# EAGLE design Adapter-LVLShifterV04 (EAGLE 7.3.0)
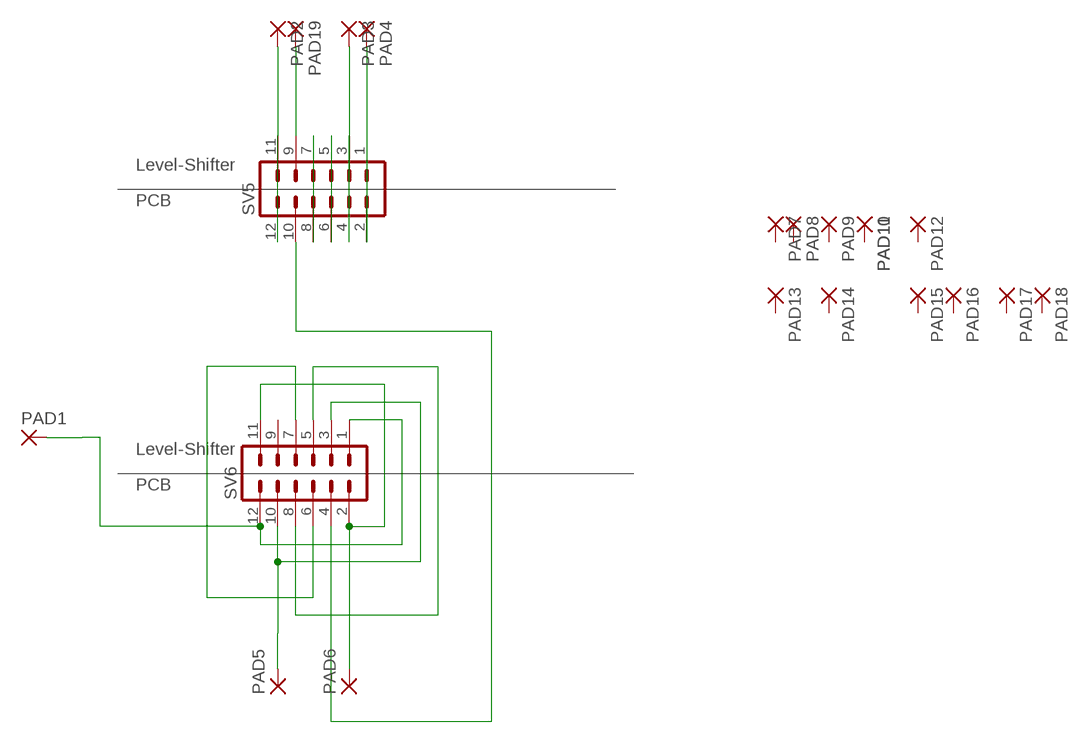
[diagram p0: schematic, sheet 1]

## Parts
PAD1  1,6/0,8  [1,6/0,8]
PAD2  1,6/0,8  [1,6/0,8]
PAD3  1,6/0,8  [1,6/0,8]
PAD4  1,6/0,8  [1,6/0,8]
PAD5  1,6/0,8  [1,6/0,8]
PAD6  1,6/0,8  [1,6/0,8]
PAD7  1,6/0,8  [1,6/0,8]
PAD8  1,6/0,8  [1,6/0,8]
PAD9  1,6/0,8  [1,6/0,8]
PAD10  1,6/0,8  [1,6/0,8]
PAD11  1,6/0,8  [1,6/0,8]
PAD12  1,6/0,8  [1,6/0,8]
PAD13  1,6/0,8  [1,6/0,8]
PAD14  1,6/0,8  [1,6/0,8]
PAD15  1,6/0,8  [1,6/0,8]
PAD16  1,6/0,8  [1,6/0,8]
PAD17  1,6/0,8  [1,6/0,8]
PAD18  1,6/0,8  [1,6/0,8]
PAD19  1,6/0,8  [1,6/0,8]
SV5  MA06-2  [MA06-2]
SV6  MA06-2  [MA06-2]

## Nets
N$1: PAD2.1(P) SV5.11 SV5.12
N$2: SV5.7 SV5.8
N$3: SV5.5 SV5.6
N$4: PAD4.1(P) SV5.1 SV5.2
N$5: PAD6.1(P) SV6.2 SV6.11
N$6: PAD1.1(P) SV6.1 SV6.12
N$7: PAD5.1(P) SV6.3 SV6.10
N$8: SV5.10 SV6.4
N$9: SV6.6 SV6.7
N$10: SV6.5 SV6.8
N$11: PAD3.1(P) SV5.3 SV5.4
N$12: PAD10.1(P) PAD11.1(P)
N$13: PAD19.1(P) SV5.9
Unconnected: PAD7.1(P) PAD8.1(P) PAD9.1(P) PAD12.1(P) PAD13.1(P) PAD14.1(P) PAD15.1(P) PAD16.1(P) PAD17.1(P) PAD18.1(P) SV6.9

## Notes on the sheet
- Level-Shifter
- PCB
- Level-Shifter
- PCB

## Library data of the parts
PAD1-PAD19 = wirepad:1,6/0,8: THROUGH-HOLE PAD
SV5 SV6 = con-lstb:MA06-2: PIN HEADER; OC_FARNELL: unknown; OC_NEWARK: unknown

## Net classes
0 default: width 0.305 mm

## Board
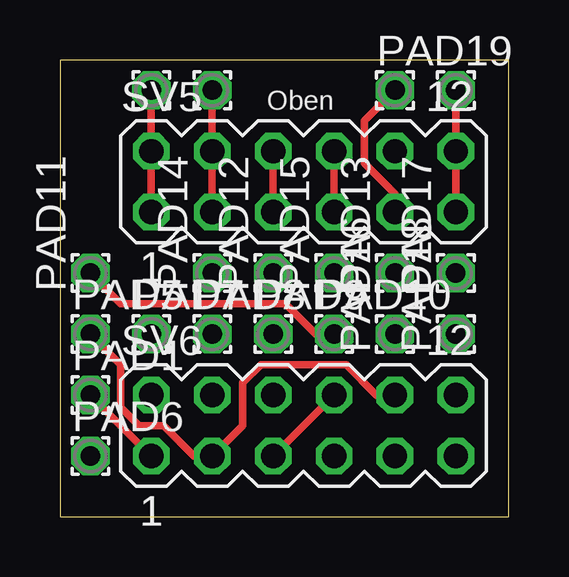
[diagram p1: board, top side]
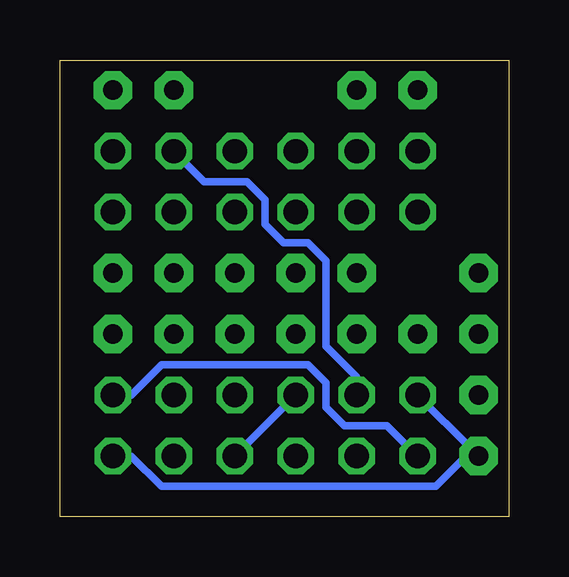
[diagram p2: board, bottom side, seen from below]

Size 18.72 x 19.04 mm. Coordinates in mm from the lower left corner, seen from the top.
Outline: 0,0 18.72,0 18.72,19.04 0,19.04 0,0
Copper layers (1*16): Top 0.035mm / dielectric 1.5mm / Bottom 0.035mm
Design rules "default": minimum track width 10mil, minimum drill 24mil, track to track 8mil, track to pad 8mil, pad to pad 8mil, via to via 8mil, smd to smd 8mil, copper to edge 40mil, drill to drill 8mil, minimum pad ring 10mil, minimum via ring 8mil, stop-mask expansion 4mil, vias tented up to drill 0mil, thermal gap 10mil

### Footprints (pad centres in the part's own frame; a part is rotated, then mirrored left to right if it is on the bottom)
1,6/0,8 = drill 0.813 pad 1.6 octagon: 1 0,0
MA06-2 = drill 1.016 octagon: 1 -6.35,-1.27; 2 -6.35,1.27; 3 -3.81,-1.27; 4 -3.81,1.27; 5 -1.27,-1.27; 6 -1.27,1.27; 7 1.27,-1.27; 8 1.27,1.27; 9 3.81,-1.27; 10 3.81,1.27; 11 6.35,-1.27; 12 6.35,1.27

### Placement (x,y rotation side)
PAD1  1.27,5.08 0 top
PAD2  16.51,17.78 0 top
PAD3  6.35,17.78 0 top
PAD4  3.81,17.78 0 top
PAD5  1.27,7.62 0 top
PAD6  1.27,2.54 0 top
PAD7  3.81,7.62 0 top
PAD8  6.35,7.62 0 top
PAD9  8.89,7.62 0 top
PAD10  11.43,7.62 0 top
PAD11  1.27,10.16 90 top
PAD12  8.89,10.16 90 top
PAD13  13.97,10.16 90 top
PAD14  6.35,10.16 90 top
PAD15  11.43,10.16 90 top
PAD16  13.97,7.62 90 top
PAD17  16.51,10.16 90 top
PAD18  16.51,7.62 90 top
PAD19  13.97,17.78 0 top
SV5  10.16,13.97 0 top
SV6  10.16,3.81 0 top

### Tracks (layer width: path | path; a pad name or v marks a point on that pad's centre or on a via)
N$1
  Top 0.305: SV5.11 SV5.12 PAD2.1
N$2
  Top 0.305: SV5.8 SV5.7
N$3
  Top 0.305: SV5.6 SV5.5
N$4
  Top 0.305: SV5.1 SV5.2 PAD4.1
N$5
  Bottom 0.305: 1.52,2.79 PAD6.1 1.52,2.79 | 1.52,2.79 SV6.2 | SV6.11 15.75,2.54 14.48,1.27 3.05,1.27 1.52,2.79
N$6
  Top 0.305: PAD1.1 SV6.1
  Bottom 0.305: SV6.12 15.75,5.08 14.48,6.35 8.38,6.35 7.62,5.59 7.62,4.57 6.86,3.81 5.08,3.81 SV6.1
N$7
  Top 0.305: PAD5.1 2.54,6.35 2.54,4.57 3.3,3.81 4.32,3.81 5.59,2.54 SV6.3 7.62,3.81 7.62,5.59 8.38,6.35 11.94,6.35 13.21,5.08 SV6.10
N$8
  Bottom 0.305: SV6.4 6.35,5.84 7.62,7.11 7.62,10.67 8.38,11.43 9.4,11.43 10.16,12.19 10.16,13.21 10.92,13.97 12.7,13.97 SV5.10
N$9
  Bottom 0.305: SV6.6 SV6.7
N$10
  Top 0.305: SV6.8 SV6.5
N$11
  Top 0.305: SV5.3 SV5.4 PAD3.1
N$12
  Top 0.305: PAD10.1 10.67,7.62 9.4,8.89 2.54,8.89 PAD11.1
N$13
  Top 0.305: SV5.9 13.97,13.46 12.7,14.73 12.7,16.51 PAD19.1

### Text on the board
tNames: Oben